# Altium schematic sheet Condor2a_Current_Sensor.SchDoc
size A4
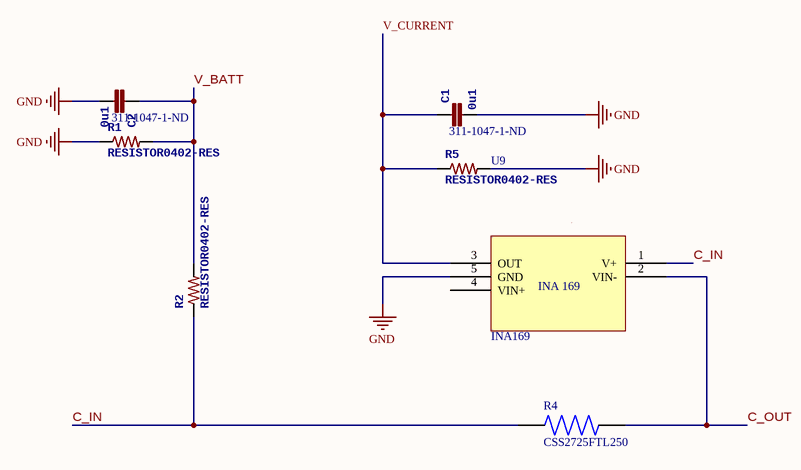
[diagram p0: Condor2a_Current_Sensor.SchDoc]

## Parts
C1  0u1  Supplier Part Number 1: 311-1047-1-ND  [0402-CAP]
C2  0u1  Supplier Part Number 1: 311-1047-1-ND  [0402-CAP]
R1  RESISTOR0402-RES  [0402-RES]
R2  RESISTOR0402-RES  [0402-RES]
R4  CSS2725FTL250  [RESC6864X124N]
R5  RESISTOR0402-RES  [0402-RES]
U9  INA169  [INA169]

## Nets
GND: C1.P$1 C2.P$1 R1.P1 R5.P2 U9.5(GND)
C_IN: R2.P1 R4.1 U9.1(V+)
C_OUT: R4.2 U9.2(VIN-)
V_BATT: C2.P$2 R1.P2 R2.P2
V_CURRENT: C1.P$2 R5.P1 U9.3(OUT)

Not connected (* = marked no-connect by the designer): U9 4(VIN+)

## Notes on the sheet
- (in symbol INA169) INA 169

## Library data of the parts
C1 C2 = CAP0402: PARTNO: CC0402ZRY5V7BB104; Supplier 1: Digi-Key
R4 = CSS2725FTL250: 250 ÂµOhms Â±1% 4W Chip Resistor Nonstandard Automotive AEC-Q200, Current Sense Metal Element; MF: Stackpole Electronics Inc; Purchase-URL: https://pricing.snapeda.com/search/part/CSS2725FTL250/?ref=eda; Package: 6864 Stackpole; Check_prices: https://www.snapeda.com/parts/CSS2725FTL250/Stackpole%20Electronics%20Inc/view-part/4222273/?ref=eda; Digi-Key_Part_Number: CSS2725FTL250CT-ND; Value: *; MP: CSS2725FTL250; SnapEDA_Link: https://www.snapeda.com/parts/CSS2725FTL250/Stackpole%20Electronics%20Inc/view-part/4222273/?ref=snap